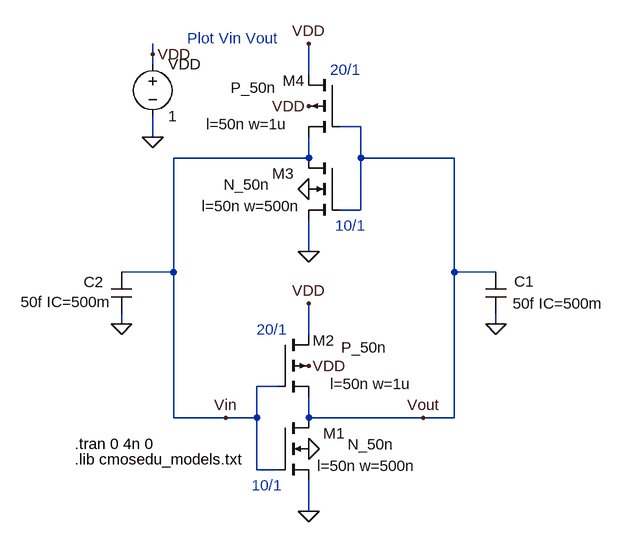
[diagram p0: schematic Fig13_17.asc]
Fig13_17.asc, the LTspice schematic file:
Version 4
SHEET 1 1136 680
WIRE 160 -320 160 -336
WIRE 208 -736 208 -752
WIRE 208 -720 208 -736
WIRE 208 -608 208 -640
WIRE 240 -400 160 -400
WIRE 240 -400 240 -576
WIRE 240 -176 240 -400
WIRE 320 -176 240 -176
WIRE 368 -176 320 -176
WIRE 368 -176 368 -224
WIRE 368 -96 368 -176
WIRE 400 -224 368 -224
WIRE 400 -96 368 -96
WIRE 448 -704 448 -752
WIRE 448 -576 240 -576
WIRE 448 -576 448 -608
WIRE 448 -432 448 -480
WIRE 448 -304 448 -352
WIRE 448 -176 448 -208
WIRE 448 -32 448 -80
WIRE 528 -624 496 -624
WIRE 528 -576 528 -624
WIRE 528 -496 496 -496
WIRE 528 -496 528 -576
WIRE 624 -176 448 -176
WIRE 672 -576 528 -576
WIRE 672 -400 672 -576
WIRE 672 -176 624 -176
WIRE 672 -176 672 -400
WIRE 736 -400 672 -400
WIRE 736 -320 736 -336
FLAG 624 -176 Vout
FLAG 448 -128 0
FLAG 208 -608 0
FLAG 208 -736 VDD
FLAG 448 -256 VDD
FLAG 448 -32 0
FLAG 448 -352 VDD
FLAG 320 -176 Vin
FLAG 448 -528 0
FLAG 448 -656 VDD
FLAG 448 -432 0
FLAG 448 -752 VDD
FLAG 736 -320 0
FLAG 160 -320 0
SYMBOL nmos4 400 -176 R0
WINDOW 0 104 24 Right 0
WINDOW 3 179 41 Right 0
WINDOW 123 213 74 Right 0
SYMATTR InstName M1
SYMATTR Value N_50n
SYMATTR Value2 l=50n w=500n
SYMBOL voltage 208 -736 R0
WINDOW 123 0 0 Left 0
WINDOW 39 0 0 Left 0
SYMATTR InstName VDD
SYMATTR Value 1
SYMBOL pmos4 400 -304 R0
WINDOW 0 88 9 Right 0
WINDOW 3 168 20 Right 0
WINDOW 123 206 76 Right 0
SYMATTR InstName M2
SYMATTR Value P_50n
SYMATTR Value2 l=50n w=1u
SYMBOL nmos4 496 -576 M0
WINDOW 0 104 24 Right 0
WINDOW 3 179 41 Right 0
WINDOW 123 213 74 Right 0
SYMATTR InstName M3
SYMATTR Value N_50n
SYMATTR Value2 l=50n w=500n
SYMBOL pmos4 496 -704 M0
WINDOW 0 88 9 Right 0
WINDOW 3 168 20 Right 0
WINDOW 123 206 76 Right 0
SYMATTR InstName M4
SYMATTR Value P_50n
SYMATTR Value2 l=50n w=1u
SYMBOL cap 720 -400 R0
WINDOW 0 44 14 Left 0
WINDOW 3 42 48 Left 0
SYMATTR InstName C1
SYMATTR Value 50f IC=500m
SYMBOL cap 144 -400 R0
WINDOW 0 -42 15 Left 0
WINDOW 3 -139 46 Left 0
SYMATTR InstName C2
SYMATTR Value 50f IC=500m
TEXT 88 -136 Left 0 !.tran 0 4n 0
TEXT 88 -112 Left 0 !.lib cmosedu_models.txt
TEXT 368 -312 Left 0 ;20/1
TEXT 360 -72 Left 0 ;10/1
TEXT 400 -760 Right 0 ;Plot Vin Vout
TEXT 528 -712 Right 0 ;20/1
TEXT 536 -472 Right 0 ;10/1

The netlist it stands for:
* Fig13_17.asc
M1 Vout Vin 0 0 N_50n l=50n w=500n
VDD VDD 0 1
M2 VDD Vin Vout VDD P_50n l=50n w=1u
M3 Vin Vout 0 0 N_50n l=50n w=500n
M4 VDD Vout Vin VDD P_50n l=50n w=1u
C1 Vout 0 50f IC=500m
C2 Vin 0 50f IC=500m
.model NMOS NMOS
.model PMOS PMOS
.lib standard.mos
.tran 0 4n 0
.lib cmosedu_models.txt
* 20/1
* 10/1
* Plot Vin Vout
* 20/1
* 10/1
.backanno
.end